# Altium schematic sheet Power.SchDoc: Power
size A4; DocumentNumber: MB1246; Revision: B.1; SheetNumber: 3; SheetTotal: 17; Project: STM32H7xxI-EVAL
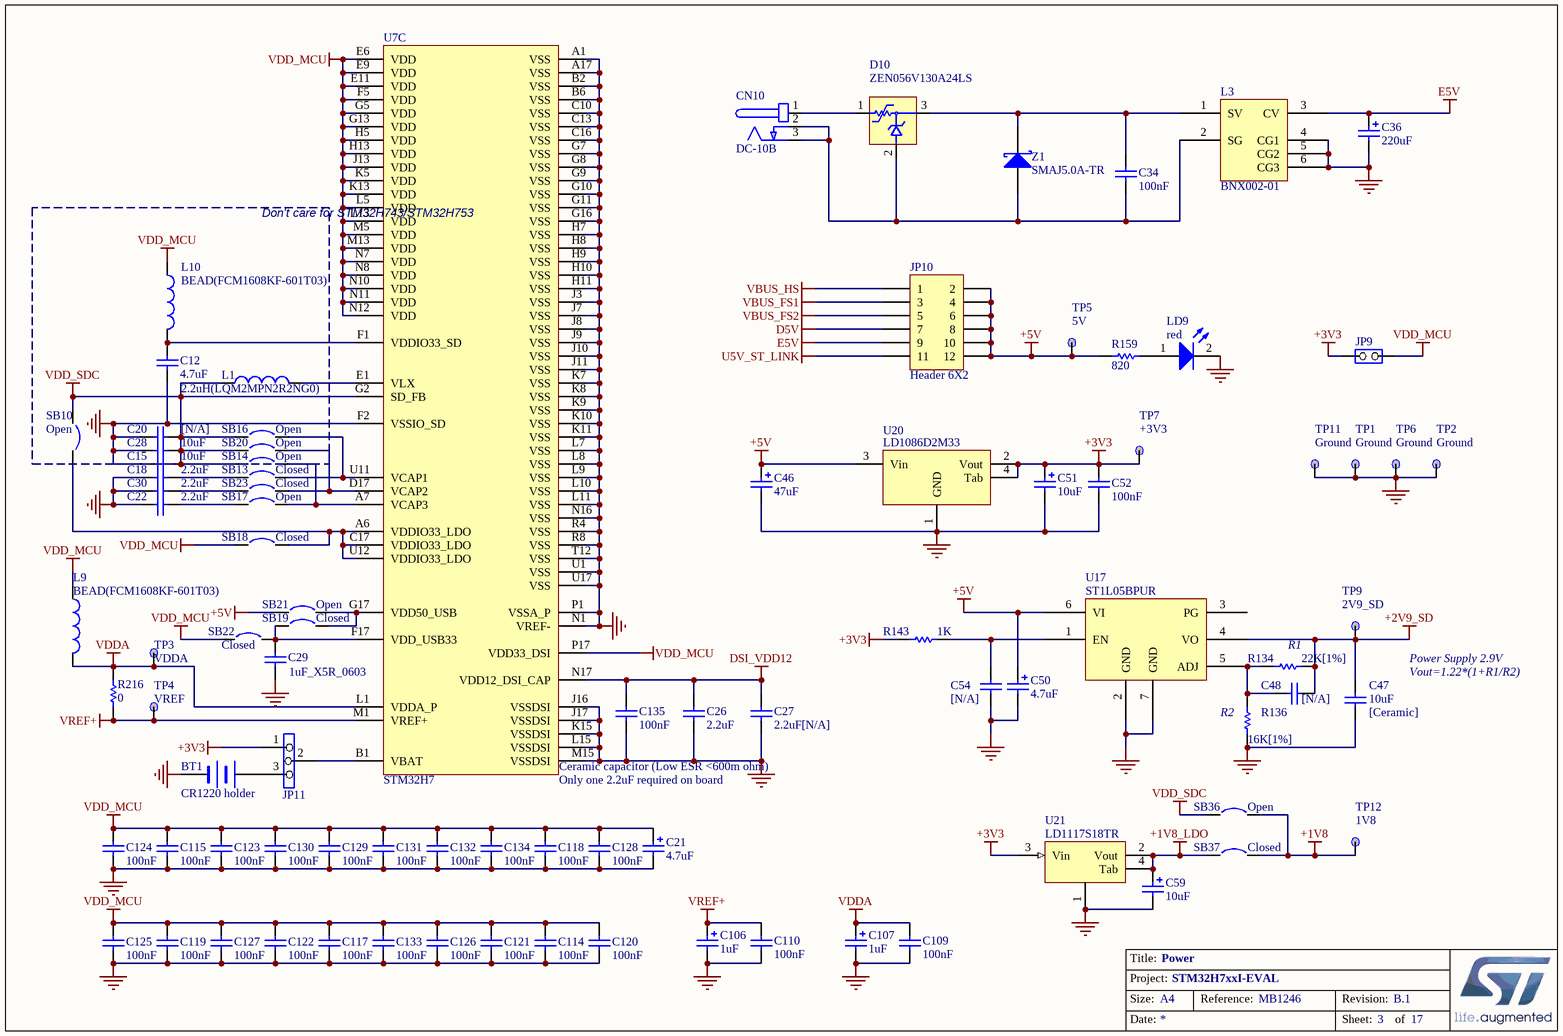
[diagram p0: Power.SchDoc]

## Parts
BT1  CR1220 holder  [BAT_2SM_CR1220]
C12  4.7uF  [0603C]
C15  10uF  [0603C]
C18  2.2uF  [0603C]
C20  [N/A]  [0603C]
C21  4.7uF  [TAN-A]
C22  2.2uF  [0603C]
C26  2.2uF  [0402C]
C27  2.2uF[N/A]  [1206C]
C28  10uF  [0603C]
C29  1uF_X5R_0603  [0603C]
C30  2.2uF  [0603C]
C34  100nF  [0603C]
C36  220uF  [c310m-6]
C46  47uF  [CAE_5R3X5R3_H5R4]
C47  10uF  [0603C]
C48  [N/A]  [0603C]
C50  4.7uF  [TAN-A]
C51  10uF  [TAN-A]
C52  100nF  [0603C]
C54  [N/A]  [0603C]
C59  10uF  [TAN-A]
C106  1uF  [TAN-A]
C107  1uF  [TAN-A]
C109  100nF  [0402C]
C110  100nF  [0402C]
C114  100nF  [0402C]
C115  100nF  [0402C]
C117  100nF  [0402C]
C118  100nF  [0402C]
C119  100nF  [0402C]
C120  100nF  [0402C]
C121  100nF  [0402C]
C122  100nF  [0402C]
C123  100nF  [0402C]
C124  100nF  [0402C]
C125  100nF  [0402C]
C126  100nF  [0402C]
C127  100nF  [0402C]
C128  100nF  [0402C]
C129  100nF  [0402C]
C130  100nF  [0402C]
C131  100nF  [0402C]
C132  100nF  [0402C]
C133  100nF  [0402C]
C134  100nF  [0402C]
C135  100nF  [0402C]
CN10  DC-10B  [PWR_JACK_DC10]
D10  ZEN056V130A24LS  [TYCO_ZEN056V130A24LS]
JP9  (no value)  [SIP2]
JP10  Header 6X2  [HDR_2X6_2R54]
JP11  (no value)  [SIP3]
L1  2.2uH(LQM2MPN2R2NG0)  [LSM2_VLS2016E_S]
L3  BNX002-01  [BNX001]
L9  BEAD(FCM1608KF-601T03)  [0603L]
L10  BEAD(FCM1608KF-601T03)  [0603L]
LD9  red  [0603D]
R134  22K[1%]  [0603R]
R136  16K[1%]  [0603R]
R143  1K  [0603R]
R159  820  [0603R]
R216  0  [0603R]
SB10  Open  [SB_0603]
SB13  Closed  [SB_0603]
SB14  Open  [SB_0603]
SB16  Open  [SB_0603]
SB17  Open  [SB_0603]
SB18  Closed  [SB_0603]
SB19  Closed  [SB_0603]
SB20  Open  [SB_0603]
SB21  Open  [SB_0603]
SB22  Closed  [SB_0603]
SB23  Closed  [SB_0603]
SB36  Open  [SB_0603]
SB37  Closed  [SB_0603]
TP1  Ground  [TP]
TP2  Ground  [TP]
TP3  VDDA  [TP]
TP4  VREF  [TP]
TP5  5V  [TP]
TP6  Ground  [TP]
TP7  +3V3  [TP]
TP9  2V9_SD  [TP]
TP11  Ground  [TP]
TP12  1V8  [TP]
U7  STM32H7  [BGA265_0R8_14X14_SKT]  (part C of 3)
U17  ST1L05BPUR  [DFN6_0R95_3X3]
U20  LD1086D2M33  [TO263-3]
U21  LD1117S18TR  [SOT-223]
Z1  SMAJ5.0A-TR  [sma]

## Blocks framed on the sheet
Don't care for STM32H743/STM32H753: C12 C15 C20 C28 L1 L10 SB10 SB14 SB16 SB20

## Nets
+1V8: SB36.2 SB37.2 TP12.1
+1V8_LDO: C59.1 SB37.1 U21.2(Vout) U21.4(Tab)
+2V9_SD: C47.1 C48.2 R134.1 TP9.1 U17.4(VO)
+3V3: C51.1 C52.1 JP9.1(COMMON) JP11.1 R143.2 TP7.1 U20.2(Vout) U20.4(Tab) U21.3(Vin)
+5V: C46.1 C50.1 JP10.2 JP10.4 JP10.6 JP10.8 JP10.10 JP10.12 R159.2 SB21.1 TP5.1 U17.6(VI) U20.3(Vin)
D5V: JP10.7
DSI_VDD12: C26.1 C27.1 C135.1 U7.N17(VDD12_DSI_CAP)
E5V: C36.1 JP10.9 L3.3(CV)
GND: BT1.2(-) C12.1 C15.1 C18.1 C20.1 C21.2 C22.1 C26.2 C27.2 C28.1 C29.1 C30.1 C36.2 C46.2 C47.2 C50.2 C51.2 C52.2 C54.2 C59.2 C106.2 C107.2 C109.1 C110.1 C114.2 C115.2 C117.2 C118.2 C119.2 C120.2 C121.2 C122.2 C123.2 C124.2 C125.2 C126.2 C127.2 C128.2 C129.2 C130.2 C131.2 C132.2 C133.2 C134.2 C135.2 L3.4(CG1) L3.5(CG2) L3.6(CG3) LD9.2(K) R136.2 TP1.1 TP2.1 TP6.1 TP11.1 U7.A1(VSS) U7.A17(VSS) U7.B2(VSS) U7.B6(VSS) U7.C10(VSS) U7.C13(VSS) U7.C16(VSS) U7.F2(VSSIO_SD) U7.G7(VSS) U7.G8(VSS) U7.G9(VSS) U7.G10(VSS) U7.G11(VSS) U7.G16(VSS) U7.H7(VSS) U7.H8(VSS) U7.H9(VSS) U7.H10(VSS) U7.H11(VSS) U7.J3(VSS) U7.J7(VSS) U7.J8(VSS) U7.J9(VSS) U7.J10(VSS) U7.J11(VSS) U7.J16(VSSDSI) U7.J17(VSSDSI) U7.K7(VSS) U7.K8(VSS) U7.K9(VSS) U7.K10(VSS) U7.K11(VSS) U7.K15(VSSDSI) U7.L7(VSS) U7.L8(VSS) U7.L9(VSS) U7.L10(VSS) U7.L11(VSS) U7.L15(VSSDSI) U7.M15(VSSDSI) U7.N1(VREF-) U7.N16(VSS) U7.P1(VSSA_P) U7.R4(VSS) U7.R8(VSS) U7.T12(VSS) U7.U1(VSS) U7.U17(VSS) U17.2(GND) U17.7(GND) U20.1(GND) U21.1
U5V_ST_LINK: JP10.11
VBUS_FS1: JP10.3
VBUS_FS2: JP10.5
VBUS_HS: JP10.1
VDD_MCU: C21.1 C114.1 C115.1 C117.1 C118.1 C119.1 C120.1 C121.1 C122.1 C123.1 C124.1 C125.1 C126.1 C127.1 C128.1 C129.1 C130.1 C131.1 C132.1 C133.1 C134.1 JP9.2(NO) L9.1 L10.1 SB18.2 SB22.1 U7.E6(VDD) U7.E9(VDD) U7.E11(VDD) U7.F5(VDD) U7.G5(VDD) U7.G13(VDD) U7.H5(VDD) U7.H13(VDD) U7.J13(VDD) U7.K5(VDD) U7.K13(VDD) U7.L5(VDD) U7.L13(VDD) U7.M5(VDD) U7.M13(VDD) U7.N7(VDD) U7.N8(VDD) U7.N10(VDD) U7.N11(VDD) U7.N12(VDD) U7.P17(VDD33_DSI)
VDD_SDC: C15.2 C20.2 C28.2 L1.1 SB10.1 SB14.1 SB16.1 SB20.1 SB36.1 U7.G2(SD_FB)
VDDA: C107.1 C109.2 L9.2 R216.1 TP3.1 U7.L1(VDDA_P)
VREF+: C106.1 C110.2 R216.2 TP4.1 U7.M1(VREF+)
NetBT1_1: BT1.1(+) JP11.3
NetC12_2: C12.2 L10.2 U7.F1(VDDIO33_SD)
NetC18_2: C18.2 SB13.2
NetC22_2: C22.2 SB17.1
NetC29_2: C29.2 SB19.1 SB22.2 U7.F17(VDD_USB33)
NetC30_2: C30.2 SB23.2
NetC34_1: C34.1 D10.3 L3.1(SV) Z1.2(K)
NetC34_2: C34.2 CN10.2(GND) CN10.3(GND) D10.2 L3.2(SG) Z1.1(A)
NetC48_1: C48.1 R134.2 R136.1 U17.5(ADJ)
NetC54_1: C54.1 R143.1 U17.1(EN)
NetCN10_1: CN10.1(+) D10.1
NetJP11_2: JP11.2 U7.B1(VBAT)
NetL1_2: L1.2 U7.E1(VLX)
NetLD9_1: LD9.1(A) R159.1
NetSB10_2: SB10.2 SB18.1 U7.A6(VDDIO33_LDO) U7.C17(VDDIO33_LDO) U7.U12(VDDIO33_LDO)
NetSB13_1: SB13.1 SB16.2 U7.U11(VCAP1)
NetSB14_2: SB14.2 SB17.2 U7.A7(VCAP3)
NetSB19_2: SB19.2 SB21.2 U7.G17(VDD50_USB)
NetSB20_2: SB20.2 SB23.1 U7.D17(VCAP2)

Not connected (* = marked no-connect by the designer): U17 3(PG)

## Notes on the sheet
- (near R134) R1
- (near R136) R2
- (near C47) [Ceramic]
- Power Supply 2.9V
- Vout=1.22*(1+R1/R2)
- (near U7) Ceramic capacitor (Low ESR <600m ohm)
- (near U7) Only one 2.2uF required on board
- Title:
- Project:
- Size:
- Date:
- A4
- Reference:
- Sheet:
- Revision:
- of

## Library data of the parts
BT1 = BATTERY
C12 C15 C18 C20 C22 C27 C28 C30 C47 C48 C52 C54 C109 C110 = Cap: Capacitor; Value: 10nF; Published: 8-Jun-2000; Revision: July-2002: Re-released for DXP Platform.; Publisher: Altium Limited
C21 C36 = Cap Pol1: Polarized Capacitor (Radial); Value: 47uF; Published: 8-Jun-2000; Revision: July-2002: Re-released for DXP Platform.; Publisher: Altium Limited
C26 = CAP: Capacitor; Value: 100nF; Published: 8-Jun-2000; Revision: July-2002: Re-released for DXP Platform.; Publisher: Altium Limited
C29 = CAP SMD 0603  X5R 1µF 25V 10%: 0603  X5R 1µF; Rated voltage: 25V; Tolerance: 10%; Manufacturer: *; Manufacturer P/N: *; Order code Farnell: 1288202RL; Value: 1µF; Power: *; Technology: X5R; Temperature  Factor: *; Temperature Max: +125°C; Temperature Min: -55°C; STS Code: *
C34 = CAP: Capacitor; Value: 100pF; Published: 8-Jun-2000; Revision: July-2002: Re-released for DXP Platform.; Publisher: Altium Limited
C46 C106 C107 = Cap Pol1: Polarized Capacitor (Radial); Value: 10uF; Published: 8-Jun-2000; Revision: July-2002: Re-released for DXP Platform.; Publisher: Altium Limited
C50 = Cap Pol1: Polarized Capacitor (Radial); Value: 100pF; Published: 8-Jun-2000; Revision: July-2002: Re-released for DXP Platform.; Publisher: Altium Limited
C51 C59 = Cap Pol1: Polarized Capacitor (Radial); Published: 8-Jun-2000; Revision: July-2002: Re-released for DXP Platform.; Publisher: Altium Limited; Value: 10uF
C114 C115 C117-C135 = CAP: Capacitor; Published: 8-Jun-2000; Revision: July-2002: Re-released for DXP Platform.; Publisher: Altium Limited; Value: 100nF
CN10 = PJ202A
JP9 = JP2
JP10 = Header 6X2: Header, 6-Pin, Dual row; Revision: 17-Jul-2002: Re-released for DXP Platform.; Publisher: Altium Limited
JP11 = Jumper3
L1 L9 L10 = Inductor: Value: 100uH; Published: 8-Jun-2000; Revision: July-2002: Re-released for DXP Platform.; Publisher: Altium Limited
L3 = BNX002
LD9 = LED2: Typical RED, GREEN, YELLOW, AMBER GaAs LED; Published: 8-Jun-2000; Revision: July-2002: Re-released for DXP Platform.; Publisher: Altium Limited
R134 R136 R216 = Res1: Resistor; Value: 1K; Published: 8-Jun-2000; Revision: July-2002: Re-released for DXP Platform.; Publisher: Altium Limited
R143 = res1: Resistor; Published: 8-Jun-2000; Revision: July-2002: Re-released for DXP Platform.; Publisher: Altium Limited; Value: 1K
R159 = res1: Resistor; Value: 1K; Published: 8-Jun-2000; Revision: July-2002: Re-released for DXP Platform.; Publisher: Altium Limited
SB10 SB14 SB16 SB17 SB20 SB21 SB36 = Circuit Breaker: Published: 24-Mar-1999; Revision: July-2002: Re-released for DXP Platform.; Publisher: Altium Limited
SB13 SB18 SB19 SB22 SB23 SB37 = Circuit Breaker_close: Circuit Breaker; Published: 24-Mar-1999; Revision: July-2002: Re-released for DXP Platform.; Publisher: Altium Limited
TP1-TP7 TP9 TP11 TP12 = TP
U7 = STM32H7_TFBGA265
U17 = ST1L05
U20 = VOLTREG1
U21 = LD1117
Z1 = D Schottky: Schottky Diode; Code - JEDEC: DO-214-AA; Published: 8-Jun-2000; Revision: July-2002: Re-released for DXP Platform.; Publisher: Altium Limited